# EasyEDA schematic Schematic- Shield.json
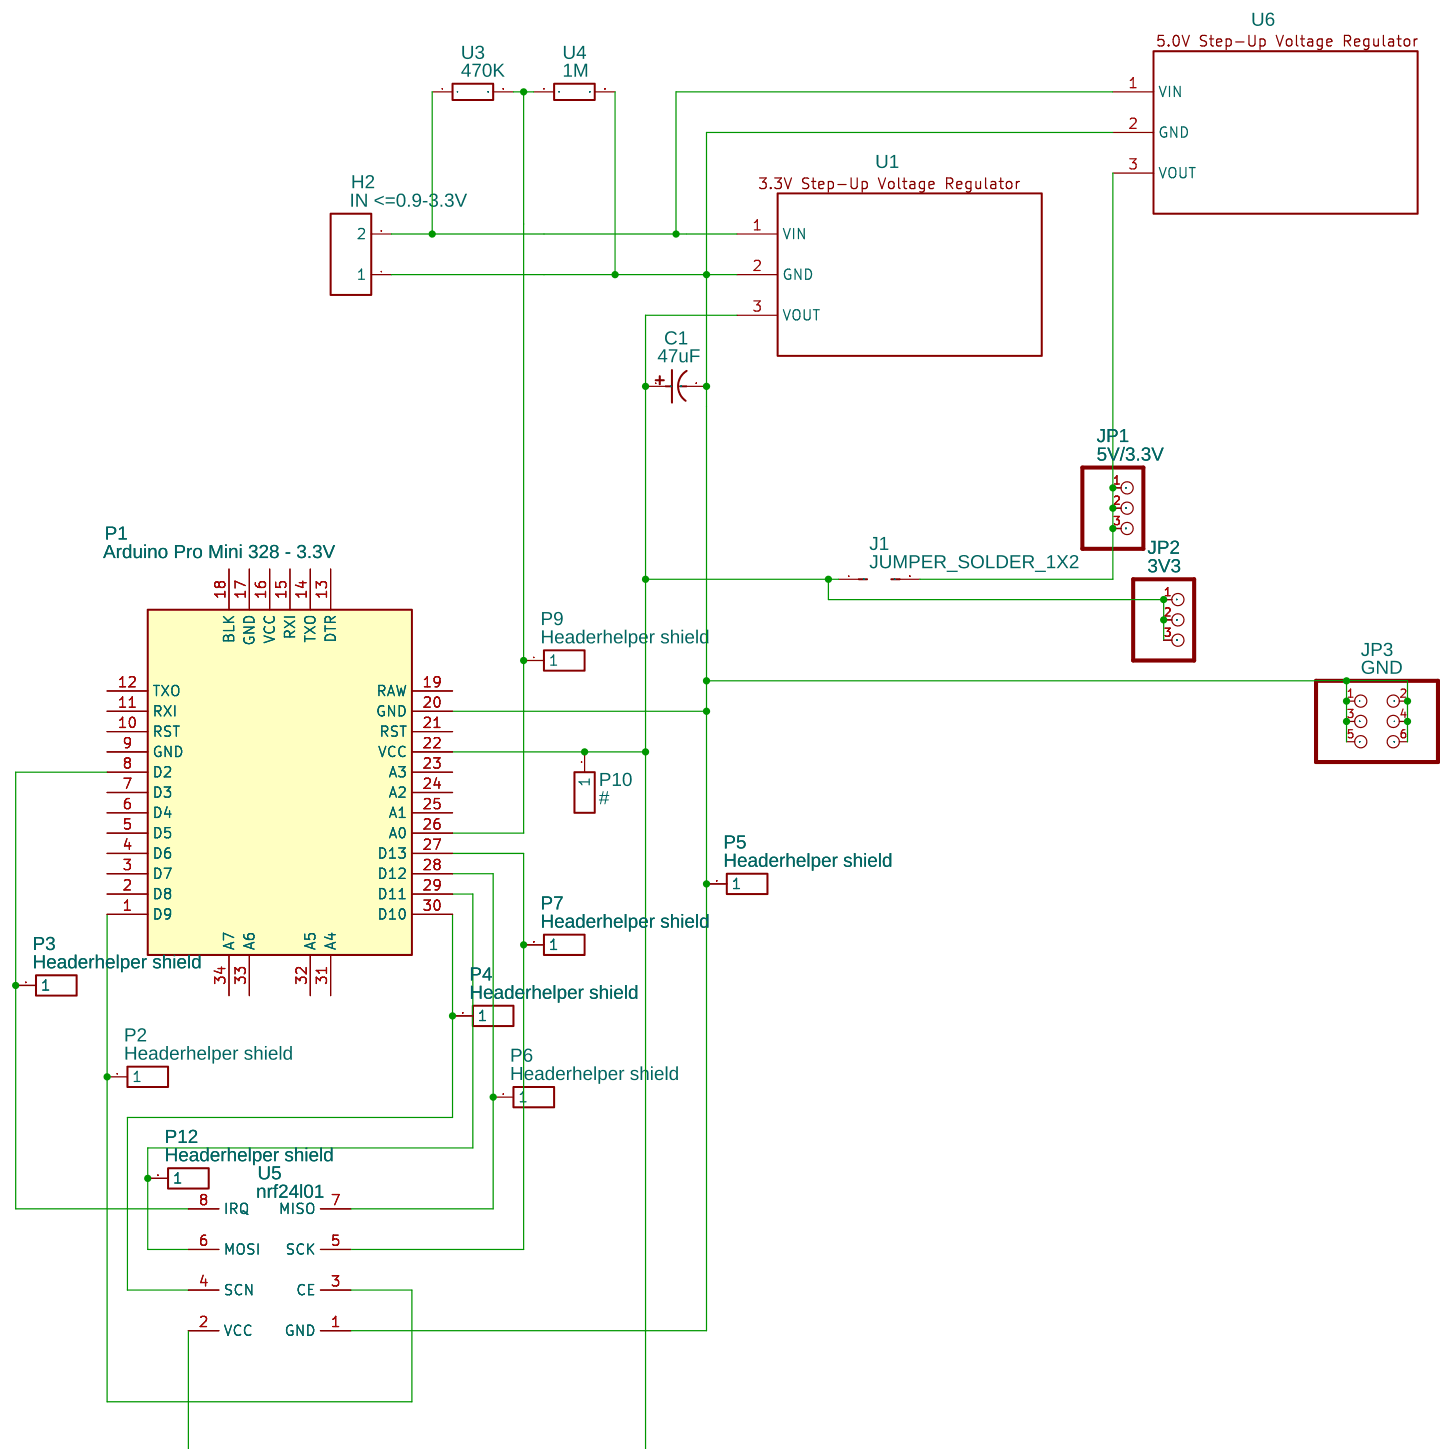
[diagram p0: schematic sheet]

## Parts
C1  47uF  [CAP-TH_BD5.0-P2.00-D0.8-FD]
H2  IN <=0.9-3.3V  [HDR-2X1/2.54]
J1  JUMPER_SOLDER_1X2  [JUMPER_SOLDER_1X2]
JP1  5V/3.3V  [1X03]
JP2  3V3  [1X03]
JP3  GND  [2X03]
P1  Arduino Pro Mini 328 - 3.3V  [MINI 328 - 3.3V]
P2  Headerhelper shield  [HDR-TH_1P-P2.54-V-M]
P3  Headerhelper shield  [HDR-TH_1P-P2.54-V-M]
P4  Headerhelper shield  [HDR-TH_1P-P2.54-V-M]
P5  Headerhelper shield  [HDR-TH_1P-P2.54-V-M]
P6  Headerhelper shield  [HDR-TH_1P-P2.54-V-M]
P7  Headerhelper shield  [HDR-TH_1P-P2.54-V-M]
P9  Headerhelper shield  [HDR-TH_1P-P2.54-V-M]
P10  #  [HDR-TH_1P-P2.54-V-M]
P12  Headerhelper shield  [HDR-TH_1P-P2.54-V-M]
U1  3.3V Step-Up Voltage Regulator NCP1402  [3.3V STEP-UP VOLTAGE REGULATOR NCP1402]
U3  470K  [AXIAL-0.4]
U4  1M  [AXIAL-0.4]
U5  nrf24l01  [NRF2401L]
U6  3.3V Step-Up Voltage Regulator NCP1402  [3.3V STEP-UP VOLTAGE REGULATOR NCP1402]

## Library data of the parts
C1 = 47UF16V: Supplier: LCSC; Manufacturer: ValuePro; Supplier Part: C30224
H2 = -: Supplier: LCSC; Manufacturer: TE Connectivity; Manufacturer Part: 826629-2; image: //image.lceda.cn/szlcsc/C86471.jpg; Supplier Part: C86471
J1 = -: Contributor: DangerousPrototype
JP1 JP2 = -: Contributor: Adafruit
JP3 = -: Contributor: SparkFun
P1 = -: sourceId: 1T5FDZYC8
P2-P7 P9 P10 P12 = -: Supplier: LCSC; Manufacturer: ReliaPro; Manufacturer Part: Header-Male-2.54_1x1; Supplier Part: C81276
U1 U6 = -: Contributor: winter2015; sourceId: YsmgyP7pj
U3 U4 = MOF2WS-470Ω±5% T: Supplier: LCSC; Manufacturer: CCO; Contributor: LCSC; Supplier Part: C121655
U5 = -: Manufacturer Part: nrf2401l; Contributor: SarKing

## Nets
Net-(C1-1): C1.1 J1.1 JP2.1 JP2.2 JP2.3 P1.22(VCC) P10.1 U1.3(VOUT) U5.2(VCC)
Net-(C1-2): C1.2 H2.1 JP3.1 JP3.2 JP3.3 JP3.4 JP3.5 JP3.6 P1.20(GND) P5.1 U1.2(GND) U4.2 U5.1(GND) U6.2(GND)
Net-(H2-2): H2.2 U1.1(VIN) U3.1 U6.1(VIN)
Net-(J1-2): J1.2 JP1.1 JP1.2 JP1.3 U6.3(VOUT)
Net-(P1-1): P1.1(D9) P2.1 U5.3(CE)
Net-(P1-8): P1.8(D2) P3.1 U5.8(IRQ)
Net-(P1-26): P1.26(A0) P9.1 U3.2 U4.1
Net-(P1-27): P1.27(D13) P7.1 U5.5(SCK)
Net-(P1-28): P1.28(D12) P6.1 U5.7(MISO)
Net-(P1-29): P1.29(D11) P12.1 U5.6(MOSI)
Net-(P1-30): P1.30(D10) P4.1 U5.4(SCN)

Not connected (* = marked no-connect by the designer): P1 2(D8) 3(D7) 4(D6) 5(D5) 6(D4) 7(D3) 9(GND) 10(RST) 11(RXI) 12(TXO) 13(DTR) 14(TXO) 15(RXI) 16(VCC) 17(GND) 18(BLK) 19(RAW) 21(RST) 23(A3) 24(A2) 25(A1) 31(A4) 32(A5) 33(A6) 34(A7)
